# EAGLE design Adafruit Pro Trinket 3v3 (EAGLE 6.3)
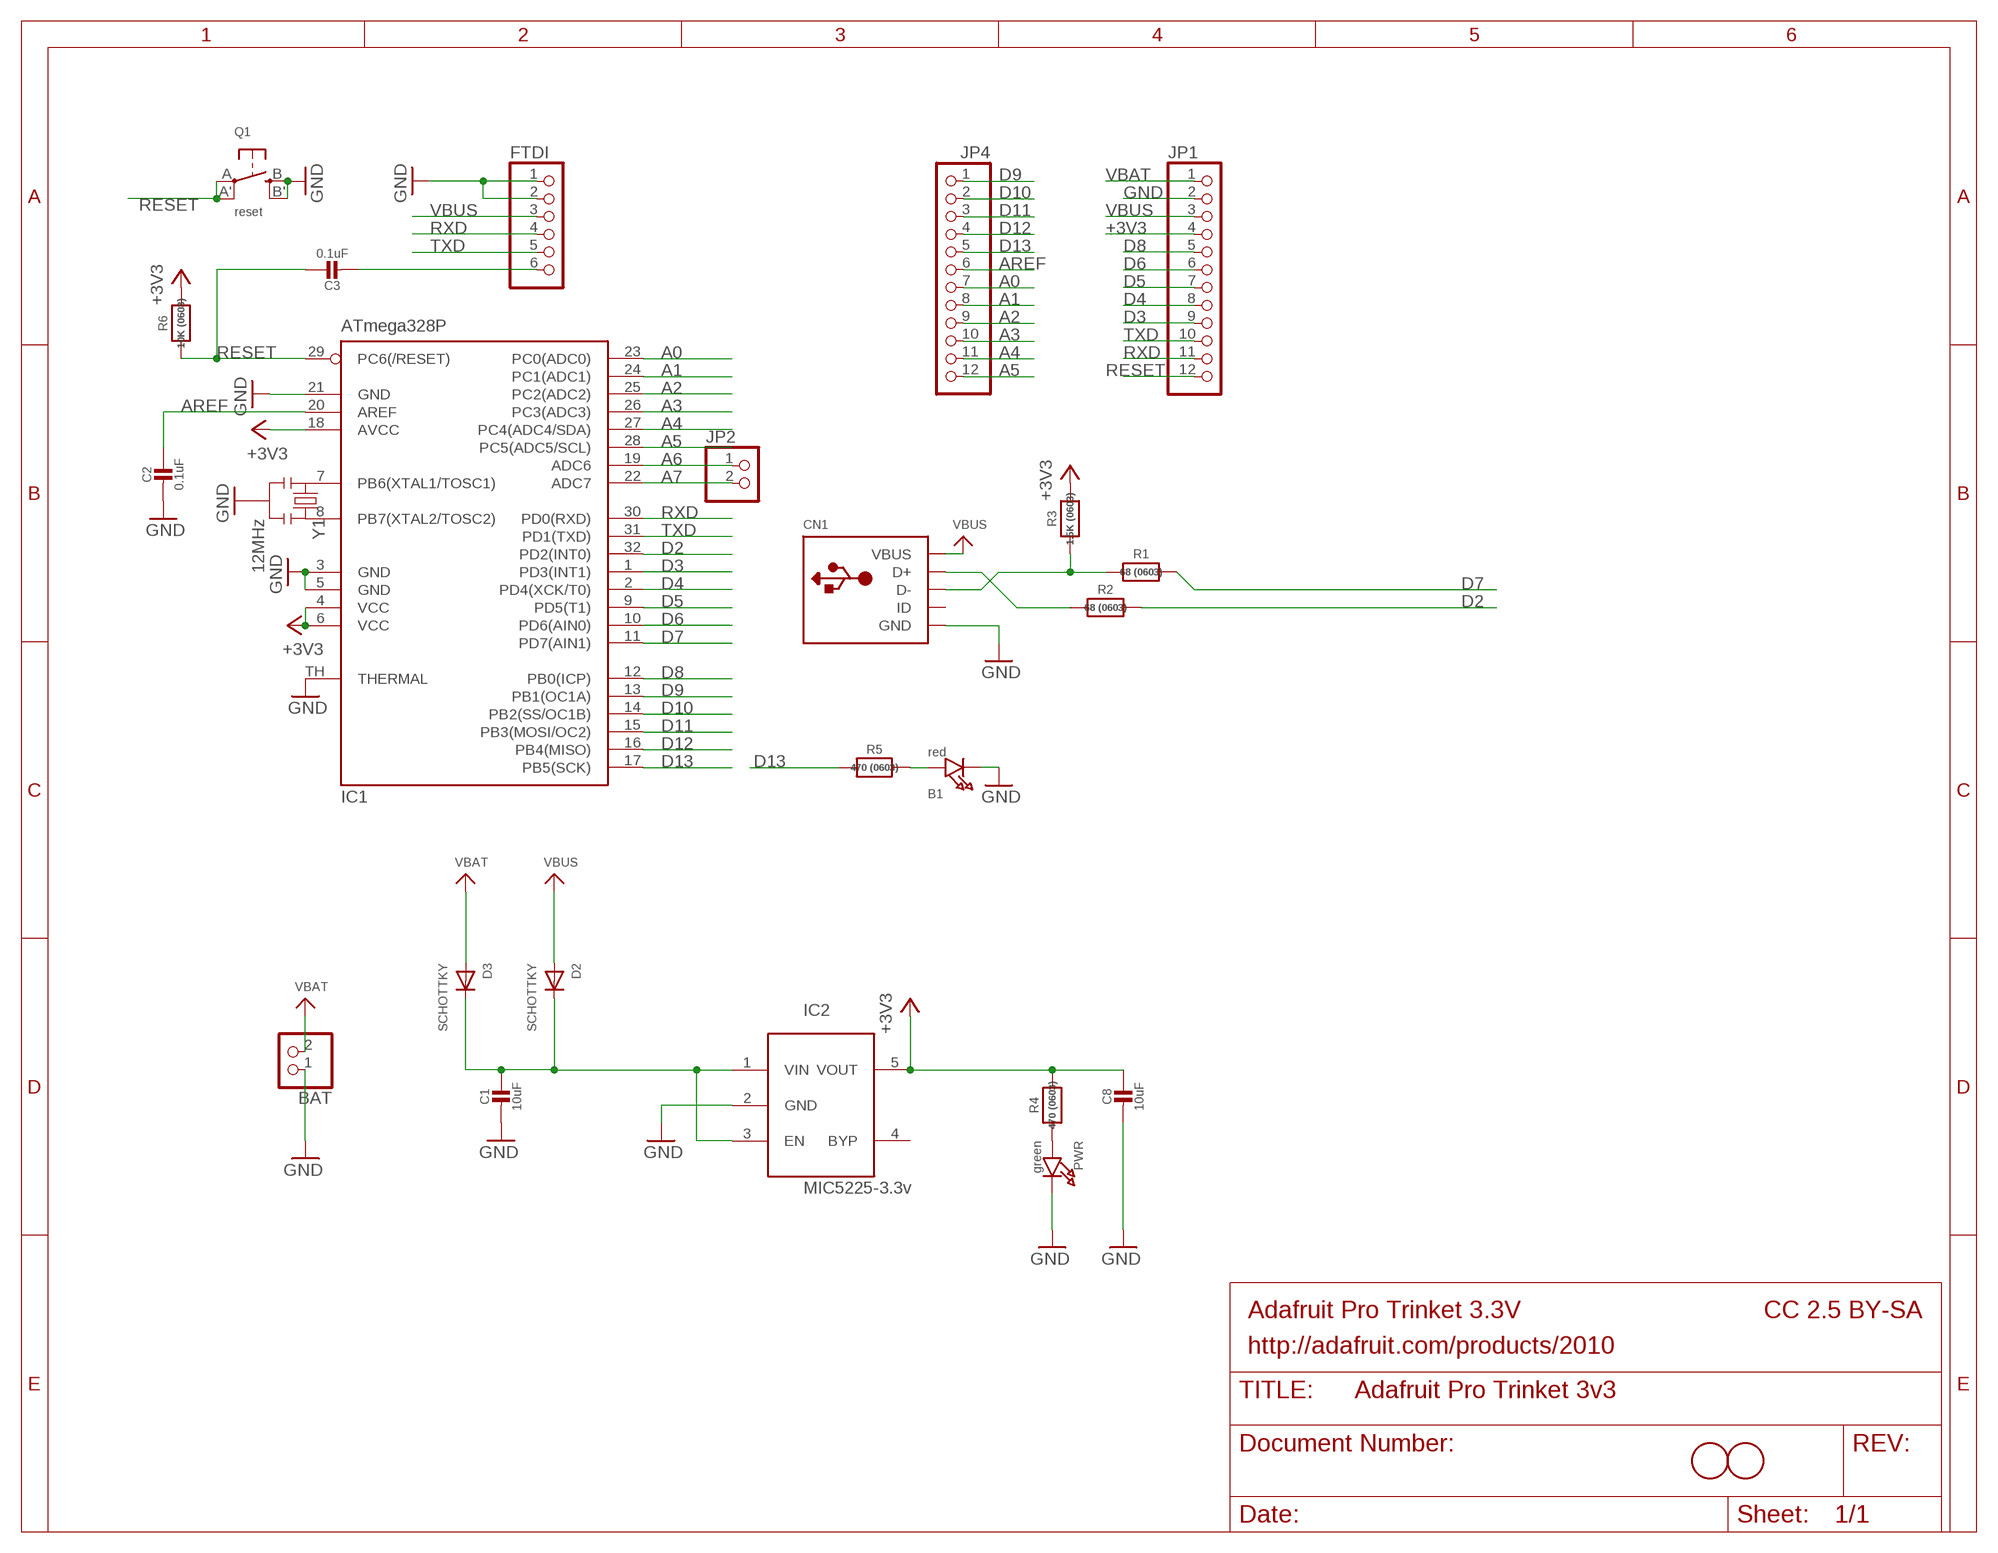
[diagram p0: schematic, sheet 1]

## Parts
B1  red  LED0805_NOOUTLINE  [CHIPLED_0805_NOOUTLINE]
BAT  CON_JST_PH_2PIN  [JSTPH2]
C1  10uF  CAP_CERAMIC0805-NOOUTLINE  [0805-NO]
C2  0.1uF  CAP_CERAMIC_0805MP  [_0805MP]
C3  0.1uF  CAP_CERAMIC0805-NOOUTLINE  [0805-NO]
C8  10uF  CAP_CERAMIC0805-NOOUTLINE  [0805-NO]
CN1  USBMICRO_20329  [4UCONN_20329]
D2  SCHOTTKY  DIODE_SOD-123FL  [SOD-123FL]
D3  SCHOTTKY  DIODE_SOD-123FL  [SOD-123FL]
FTDI  PINHD-1X6CB  [1X06-CLEANBIG]
IC1  ATmega328P  MEGA8-MI  [MLF32-TH]
IC2  MIC5225-3.3v  LP298XS  [SOT23-5L]
JP1  PINHD-1X12-CB  [1X12-CB]
JP2  HEADER-1X2ROUND  [1X02_ROUND]
JP4  PINHD-1X12-CB  [1X12-CB]
PWR  green  LED0805_NOOUTLINE  [CHIPLED_0805_NOOUTLINE]
Q1  reset  SWITCH_TACT_SMT4.6X2.8  [BTN_KMR2_4.6X2.8]
R1  68 (0603)  RESISTOR_0603_NOOUT  [0603-NO]
R2  68 (0603)  RESISTOR_0603_NOOUT  [0603-NO]
R3  1.5K (0603)  RESISTOR_0603_NOOUT  [0603-NO]
R4  470 (0603)  RESISTOR_0603_NOOUT  [0603-NO]
R5  470 (0603)  RESISTOR_0603_NOOUT  [0603-NO]
R6  10K (0603)  RESISTOR0805_NOOUTLINE  [0805-NO]
U$1  FIDUCIAL  [FIDUCIAL_1MM]
U$6  FIDUCIAL  [FIDUCIAL_1MM]
Y1  12MHz  RESONATORSMD  [RESONATOR-SMD]

## Nets
+3V3 [power]: C8.1 IC1.4(VCC) IC1.6(VCC) IC1.18(AVCC) IC2.5(VOUT) JP1.4 R3.2 R4.2 R6.2
A0: IC1.23(PC0(ADC0)) JP4.7
A1: IC1.24(PC1(ADC1)) JP4.8
A2: IC1.25(PC2(ADC2)) JP4.9
A3: IC1.26(PC3(ADC3)) JP4.10
A4: IC1.27(PC4(ADC4/SDA)) JP4.11
A5: IC1.28(PC5(ADC5/SCL)) JP4.12
A6: IC1.19(ADC6) JP2.1
A7: IC1.22(ADC7) JP2.2
AREF: C2.1 IC1.20(AREF) JP4.6
D2: IC1.32(PD2(INT0)) R2.2
D3: IC1.1(PD3(INT1)) JP1.9
D4: IC1.2(PD4(XCK/T0)) JP1.8
D5: IC1.9(PD5(T1)) JP1.7
D6: IC1.10(PD6(AIN0)) JP1.6
D7: IC1.11(PD7(AIN1)) R1.2
D8: IC1.12(PB0(ICP)) JP1.5
D9: IC1.13(PB1(OC1A)) JP4.1
D10: IC1.14(PB2(SS/OC1B)) JP4.2
D11: IC1.15(PB3(MOSI/OC2)) JP4.3
D12: IC1.16(PB4(MISO)) JP4.4
D13: IC1.17(PB5(SCK)) JP4.5 R5.2
D+: CN1.D+ R2.1
D-: CN1.D- R1.1 R3.1
DTR/RTS: C3.2 FTDI.6
GND [power]: B1.C BAT.1 C1.2 C2.2 C8.2 CN1.BASE@1(GND) CN1.BASE@2(GND) CN1.GND CN1.SPRT@1(GND) CN1.SPRT@2(GND) CN1.SPRT@3(GND) CN1.SPRT@4(GND) FTDI.1 FTDI.2 IC1.3(GND) IC1.5(GND) IC1.21(GND) IC1.TH(THERMAL) IC2.2(GND) JP1.2 PWR.C Q1.B'(S1) Q1.B(S) Y1.2
N$1: B1.A R5.1
N$2: IC1.8(PB7(XTAL2/TOSC2)) Y1.3
N$3: IC1.7(PB6(XTAL1/TOSC1)) Y1.1
N$6: PWR.A R4.1
N$7: C1.1 D2.C D3.C IC2.1(VIN) IC2.3(EN)
RESET: C3.1 IC1.29(PC6(/RESET)) JP1.12 Q1.A'(P1) Q1.A(P) R6.1
RXD: FTDI.4 IC1.30(PD0(RXD)) JP1.11
TXD: FTDI.5 IC1.31(PD1(TXD)) JP1.10
VBAT [power]: BAT.2 D3.A JP1.1
VBUS [power]: CN1.VBUS D2.A FTDI.3 JP1.3
Unconnected: CN1.ID IC2.4(BYP)

## Notes on the sheet
- Adafruit Pro Trinket 3.3V | CC 2.5 BY-SA
- http://adafruit.com/products/2010

## Library data of the parts
B1 PWR = microbuilder:LED: LED 0603 - 0603 Surface Mount Package 2mA: Green LED - Low Power (3.9mcd, 2ma, 1.7Vf) - Digikey: 475-2709-2-ND Orange LED - Low Power (9.8mcd, 2ma, 1.8Vf) - Digikey: 475-1194-2-ND Red LED - Low Power (5mcd, 2ma, 1.8Vf) - Digikey: 475-1195-2-ND Yellow LED - Low Power (7mcd, 2ma, 1.8Vf) - Digikey: 475-1196-2-ND 5mA: Blue LED - Low Power (17mcd, 5ma, 2.9Vf) - Digikey: LNJ937W8CRACT-ND 0805 - 0805 Surface Mount Package 2mA: Red LED (8.8mcd, 2mA, 1.8Vf, Clear) - Low Power [Digikey: 475-2510-1-ND] Green LED (5mcd, 2mA, 1.8Vf, Clear) - Low Power [Digikey: 475-2730-1-ND] Yellow LED (11.3mcd, 2mA, 1.8Vf, Clear) - Low Power [Digikey: 475-2555-1-ND] 20mA: Red LED (104mcd, 20mA, Diffused) - LS R976 [Digikey: 475-1278-6-ND] Red LED (12mcd, 20mA, 2.0Vf, Clear) - APT2012EC [Digikey: 754-1128-1-ND] Green LED (15mcd, 20mA, 2.2Vf, Clear) - APT2012GC [Digikey: 754-1131-1-ND] Orange LED (160mcd, 20mA, 2.1Vf, Clear) - APT2012SECK [Digikey: 754-1130-1-ND] 1206 - 1206 Surface Mount Package Green LED (26mcd, 20mA, Diffused) - LG N971 [Digikey: 475-1407-6-ND] Red LED (15mcd, 20mA, Diffused) - LH N974 [Digikey: 475-1416-6-ND] Cree - Cree High-Power Surface Mount LEDs XPEBWT-L1-0000-00D50 - White 111lm 350mA 2.9Vf 6200K 110° XTEAWT-00-0000-00000LEE3 - White 114lm 350mA 2.85Vf 5000K 115° Everlight - Everlight 45-21 Series Surface Mount LEDs 45-21/QK2C-B2832AC2CB2/2T - Warm White 2000mcd 20mA 3.25Vf 3050K 120° 45-21/LK2C-B38452C4CB2/2T - Nuetral White 2000mcd 20mA 3.25Vf 4150K 120° 45-21/LK2C-B50634C6CB2/2T - Cold White 2200mcd 20mA 3.25Vf 5650K 120° PLCC2 Reverse Mount LS T77K-J1L2-1-0-2-R18-Z - Red 11.25mcd 2mA 1.8Vf 630nm 120° LO T77K-L1M2-24-Z - Orange 19.6mcd 2mA 1.8Vf 606nm 120° LY T77K-K2M1-26-Z - Yellow 15.7mcd 2mA 1.8Vf 587nm 120°
BAT = microbuilder:CON_JST_PH_2PIN: JST 2-Pin Right-Angle Connector PH-Series - 4UConnector: 17311 SH-Series - 4UConnector: 07278
C1-C3 C8 = microbuilder:CAP_CERAMIC: Ceramic Capacitors For new designs, use the packages preceded by an '_' character since they are more reliable: The following footprints should be used on most boards: _0402 - Standard footprint for regular board layouts _0603 - Standard footprint for regular board layouts _0805 - Standard footprint for regular board layouts _1206 - Standard footprint for regular board layouts For extremely tight-pitch boards where space is at a premium, the following 'micro-pitch' footprints can be used (smaller pads, no silkscreen outline, etc.): _0402MP - Micro-pitch footprint for very dense/compact boards _0603MP - Micro-pitch footprint for very dense/compact boards _0805MP - Micro-pitch footprint for very dense/compact boards _1206MP - Micro-pitch footprint for very dense/compact boards
CN1 = microbuilder:USB: USB Connectors USBMINIB - Surface Mount Female Mini-B USB Connector 4UConnector: 06564
D2 D3 = adafruit:DIODE: Diode SMADIODE - SMA Surface Mount Package 20V 1A Schottky Diode Digikey: 641-1014-6-ND DO-1N4148 - Through Hole Small Current Diode SOD-123 20V 1 A (.5mV Vf) Schottky Diode - Digikey: MBRX120TPMSCT-ND SOD-323 10V 570mA (.38mV Vf, 3ns) Schottky Diode - Digikey: ZLLS410CT-ND SOD-523 30V 30mA Schottky Diode (RB751S-40TE61) - Digikey: RB751S-40TE61CT-ND SOT23-R/W - SOT23 Package (R = Solder Paste/Reflow Ovens, W = Hand-Soldering) BAT54Film 40V 300mA - Digikey: 497-7162-1-ND
FTDI = adafruit:PINHD-1X6: PIN HEADER
IC1 = microbuilder:MEGA8-MI: MICROCONTROLLER 8 Kbytes FLASH, 1 kbytes SRAM, 512 bytes EEPROM, USART, 6-channel 10 bit ADC, 2-channel 8 bit ADC Pin compatible with Atmega48, ATMega88, ATMega168 Source: avr.lbr; MPN: ATMEGA88PA-MU; OC_FARNELL: 1715491; OC_NEWARK: 15R0272
IC2 = adafruit:LP298X
JP1 JP4 = adafruit:PINHD-1X12: PIN HEADER
JP2 = microbuilder:HEADER-1X2: PIN HEADER
Q1 = microbuilder:SWITCH_TACT_SMT: SMT Tact Switches 6x6mm - Digikey: P12940SCT-ND KMR2 (4.6x2.8mm) - Digikey: 401-1426-1-ND EVQ-PQHB55 - Light Touch, 160GF (4.5x4.5mm) - Digikey: P8090SCT-ND KMT0 - KMT021 NGJ LHS (etc.) IP68/Waterproof - Digikey: CKN10289CT-ND
R1-R6 = microbuilder:RESISTOR: Resistors For new designs, use the packages preceded by an '_' character since they are more reliable: The following footprints should be used on most boards: _0402 - Standard footprint for regular board layouts _0603 - Standard footprint for regular board layouts _0805 - Standard footprint for regular board layouts _1206 - Standard footprint for regular board layouts For extremely tight-pitch boards where space is at a premium, the following 'micro-pitch' footprints can be used (smaller pads, no silkscreen outline, etc.): _0402MP - Micro-pitch footprint for very dense/compact boards _0603MP - Micro-pitch footprint for very dense/compact boards _0805MP - Micro-pitch footprint for very dense/compact boards _1206MP - Micro-pitch footprint for very dense/compact boards
U$1 U$6 = adafruit:FIDUCIAL: For use by pick and place machines to calibrate the vision/machine, 1mm By microbuilder.eu
Y1 = SparkFun:RESONATOR: Resonator Small SMD resonator. This is the itty bitty 10/20MHz resonators with built in caps. CSTCE10M0G55 and CSTCE20M0V53. Footprint has been reviewed closely but hasn't been tested yet.

## Net classes
1 power: width 0.305 mm

## Board
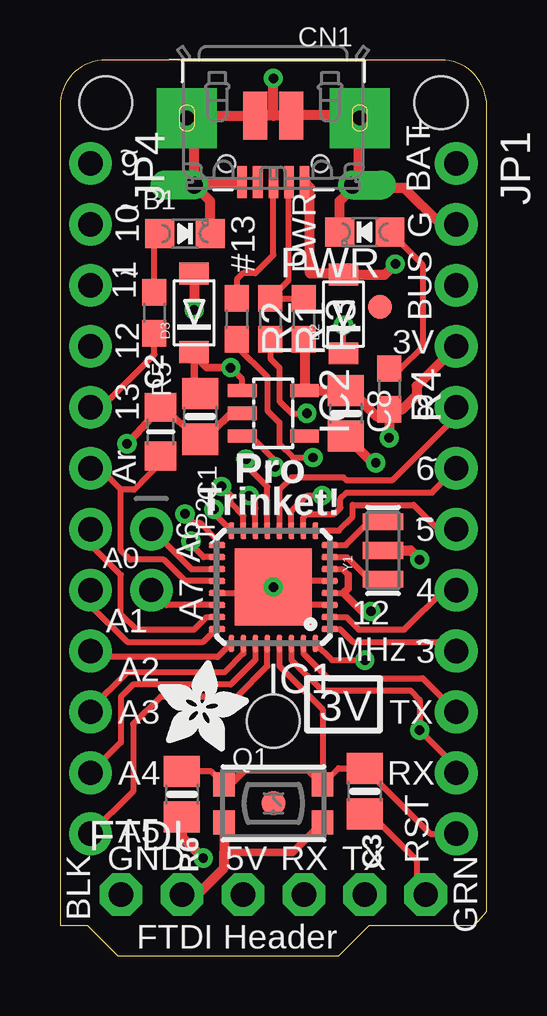
[diagram p1: board, top side]
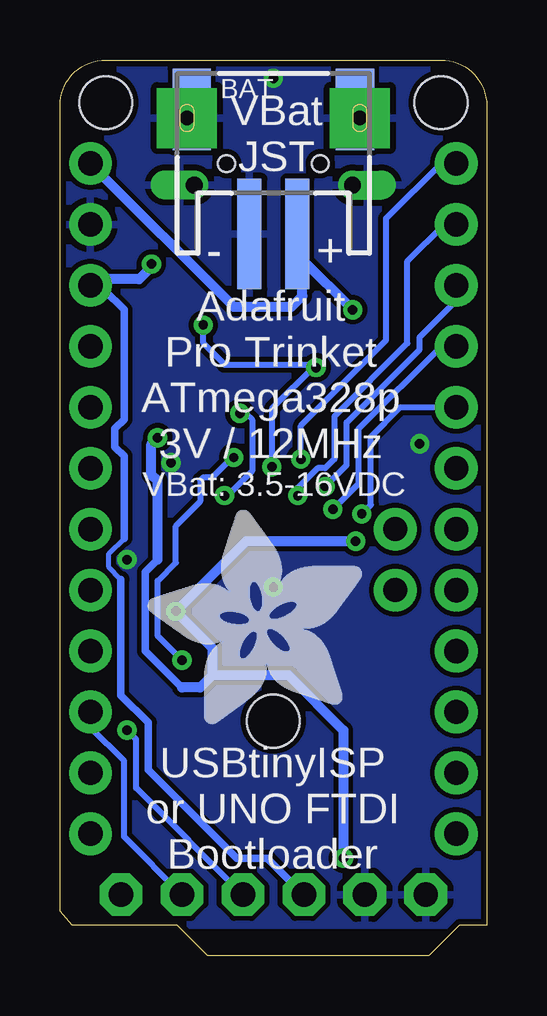
[diagram p2: board, bottom side, seen from below]

Size 17.78 x 37.34 mm. Coordinates in mm from the lower left corner, seen from the top.
Outline: 17.78,1.84 17.78,35.43 arc90 15.88,37.34 1.91,37.34 arc90 0,35.43 0,1.27 1.14,1.27 2.41,0 11.62,0 12.89,1.27 17.27,1.27 17.78,1.84
Copper layers (1*16): Top 0.035mm / dielectric 1.5mm / Bottom 0.035mm
Design rules "adafruit *": minimum track width 8mil, minimum drill 15.5mil, track to track 8mil, track to pad 8mil, pad to pad 8mil, via to via 8mil, smd to smd 8mil, copper to edge 10mil, drill to drill 8mil, minimum pad ring 10mil, minimum via ring 8mil, stop-mask expansion 2mil, vias tented up to drill 20mil, thermal gap 10mil
Holes 2.2 mm at 1.91,35.56 15.88,35.56 8.89,9.78

### Footprints (pad centres in the part's own frame; a part is rotated, then mirrored left to right if it is on the bottom)
CHIPLED_0805_NOOUTLINE = smd 1.2 x 1.2: A 0,-1.05; C 0,1.05
JSTPH2 = smd 1 x 4.6: 1 -1,-3.7; 2 1,-3.7 | smd 1.6 x 3.4: NC1 -3.4,1.5; NC2 3.4,1.5
0805-NO = smd 1.3 x 1.5: 1 -0.95,0; 2 0.95,0
_0805MP = smd 1.2 x 1.3: 1 -1.016,0; 2 1.016,0
4UCONN_20329 = smd 1 x 2: BASE@1 -0.75,-2; BASE@2 0.75,-2 | smd 0.4 x 1.35: D+ 0,0.775; D- -0.65,0.775; GND 1.3,0.775; ID 0.65,0.775; VBUS -1.3,0.775 | drill 0.7 offset: SPRT@1 -3.3,0.9; SPRT@2 3.3,0.9 | drill 0.6 pad 2.5 square: SPRT@3 -3.6,-1.9; SPRT@4 3.6,-1.9 | hole 0.7: -1.95,0; 1.95,0
SOD-123FL = smd 0.91 x 1.22: A 1.637,0; C -1.637,0
1X06-CLEANBIG = drill 1.016 pad 1.778 octagon: 1 -6.35,0; 2 -3.81,0; 3 -1.27,0; 4 1.27,0; 5 3.81,0; 6 6.35,0
MLF32-TH = smd 0.7 x 0.25: 1 -2.35,1.75; 2 -2.35,1.25; 3 -2.35,0.75; 4 -2.35,0.25; 5 -2.35,-0.25; 6 -2.35,-0.75; 7 -2.35,-1.25; 8 -2.35,-1.75; 17 2.35,-1.75; 18 2.35,-1.25; 19 2.35,-0.75; 20 2.35,-0.25; 21 2.35,0.25; 22 2.35,0.75; 23 2.35,1.25; 24 2.35,1.75 | smd 0.25 x 0.7: 9 -1.75,-2.35; 10 -1.25,-2.35; 11 -0.75,-2.35; 12 -0.25,-2.35; 13 0.25,-2.35; 14 0.75,-2.35; 15 1.25,-2.35; 16 1.75,-2.35; 25 1.75,2.35; 26 1.25,2.35; 27 0.75,2.35; 28 0.25,2.35; 29 -0.25,2.35; 30 -0.75,2.35; 31 -1.25,2.35; 32 -1.75,2.35 | smd 3.2 x 3.2: TH 0,0
SOT23-5L = smd 0.55 x 1.2: 1 -0.95,-1.3; 2 0,-1.3; 3 0.95,-1.3; 4 0.95,1.3; 5 -0.95,1.3
1X12-CB = drill 1.016 pad 1.778: 1 -13.97,0; 2 -11.43,0; 3 -8.89,0; 4 -6.35,0; 5 -3.81,0; 6 -1.27,0; 7 1.27,0; 8 3.81,0; 9 6.35,0; 10 8.89,0; 11 11.43,0; 12 13.97,0
1X02_ROUND = drill 1 pad 1.778: 1 -1.27,0; 2 1.27,0
BTN_KMR2_4.6X2.8 = smd 0.9 x 1: A 2.05,0.8; A' -2.05,0.8; B 2.05,-0.8; B' -2.05,-0.8
0603-NO = smd 1.1 x 1: 1 -0.85,0; 2 0.85,0
FIDUCIAL_1MM = smd 1 x 1: 1 0,0
RESONATOR-SMD = smd 0.7 x 1.7: 1 -1.2,0; 2 0,0; 3 1.2,0

### Placement (x,y rotation side)
B1  5.21,30.1 270 top
BAT  8.89,33.78 0 bottom
C1  5.84,22.48 270 top
C2  4.19,21.84 90 top
C3  12.7,6.86 270 top
C8  11.91,22.61 270 top
CN1  8.89,33.02 180 top
D2  11.81,26.75 90 top
D3  5.59,26.8 90 top
FTDI  8.89,2.54 0 top
IC1  8.89,15.37 180 top
IC2  8.89,22.61 270 top
JP1  16.51,19.05 270 top
JP2  3.81,16.51 270 top
JP4  1.27,19.05 270 top
PWR  12.7,30.16 90 top
Q1  8.89,6.35 0 top
R1  8.76,26.54 270 top
R2  7.37,26.54 270 top
R3  10.16,26.54 270 top
R4  13.72,23.62 270 top
R5  3.94,26.8 270 top
R6  5.08,6.73 270 top
U$1  13.34,27.05 0 top
U$6  8.89,6.35 0 top
U$7  [ADAFRUIT_3.5MM]  4.06,8.51 0 top
U$9  [ADAFRUIT_9MM]  5.21,9.65 90 bottom
Y1  13.46,16.89 90 top

### Tracks (layer width: path | path; a pad name or v marks a point on that pad's centre or on a via)
+3V3  (via drill 0.39)
  Top 0.254: IC1.18 5.99,16.62 5.46,17.14 | IC1.6 11.76,16.12 12,15.88 | IC1.4 11.81,15.12 11.81,15.11
  Top 0.305: 12,15.88 12,15.3 11.81,15.11 12.57,14.35 v12.95,14.35 | 5.46,17.14 v5.46,17.27
  Top 0.406: 10.29,23.65 IC2.5 | IC2.5 C8.1 12.13,23.56 13.21,22.48 13.63,22.48 13.63,22.68 R4.2 | JP1.4 14.86,23.75 14.86,23.37 14.26,22.77 R4.2 | R4.2 v13.72,21.59 | R3.2 10.19,25.66 IC2.5 | R6.2 5.08,4.95 v5.97,4.06
  Bottom 0.305: 12.7,11.18 14.22,12.7 14.22,16 13.72,16.51
  Bottom 0.406: 13.72,16.51 13.72,19.81 13.97,20.07 13.97,21.34 v13.72,21.59 | 11.43,11.68 8.26,11.68 5.97,9.4 v5.97,4.06 | 11.43,11.68 11.94,11.18 12.7,11.18 | v5.46,17.27 10.03,17.27 v12.95,14.35 11.43,12.83 11.43,11.68
A0
  Top 0.254: IC1.23 6.12,14.12 5.59,13.59 3.18,13.59 2.54,14.22 2.54,15.88 1.27,17.14 JP4.7
A1
  Top 0.254: JP4.8 1.27,14.61 2.79,13.08 5.97,13.08 6.51,13.62 IC1.24
A2
  Top 0.254: 7.14,12.86 IC1.25 6.57,12.45 1.52,12.45 JP4.9
A3
  Top 0.254: JP4.10 1.27,10.29 2.79,11.81 6.86,11.81 7.64,12.59 IC1.26
A4
  Top 0.254: JP4.11 2.54,8.89 2.54,10.79 3.05,11.3 7.11,11.3 8.14,12.33 IC1.27
A5
  Top 0.254: IC1.28 8.64,12.07 7.37,10.79 4.19,10.79 3.05,9.65 3.05,6.86 JP4.12
A6
  Top 0.254: JP2.1 5.47,16.12 IC1.19
A7
  Top 0.254: IC1.22 4.43,14.62 JP2.2
AREF
  Top 0.254: IC1.20 5.21,15.62 4.32,16.51 2.92,16.51 2.54,16.89 2.54,19.43 | 2.54,19.43 1.65,20.32 JP4.6 | 2.54,19.43 3.09,19.43 4.23,20.61 C2.1
D2  (via drill 0.39)
  Top 0.254: v12.7,12.32 11.34,12.32 IC1.32 | 10.03,20.76 v10.54,20.76 9.72,20.76 9.14,21.34 9.14,22.22 8.64,22.73 8.64,24.13 7.37,25.4 R2.2
  Bottom 0.254: v12.7,12.32 13.72,13.33 13.72,15.62 12.95,16.38 12.95,17.91 11.94,18.92 11.94,19.81 11.81,19.94 11.43,19.94 10.6,20.76 v10.54,20.76
D3
  Top 0.254: IC1.1 11.66,13.62 12.19,13.08 16.13,13.08 JP1.9
D4
  Top 0.254: IC1.2 11.92,14.12 12.45,13.59 14.35,13.59 16,15.24 JP1.8
D5
  Top 0.254: IC1.9 11.62,17.72 12.19,18.29 12.19,18.8 14.73,18.8 15.75,17.78 JP1.7
D6
  Top 0.254: IC1.10 10.14,18.27 10.29,18.41 11.43,18.41 11.68,18.67 11.68,19.05 11.94,19.3 15.49,19.3 JP1.6
D7  (via drill 0.39)
  Top 0.254: R1.2 8.76,24.89 9.14,24.51 9.14,23.11 9.65,22.61 v10.29,22.61 | IC1.11 9.64,18.53 10.29,19.18 v10.92,19.18
  Bottom 0.254: v10.29,22.61 10.03,22.61 9.78,22.35 9.78,20.19 10.79,19.18 v10.92,19.18
D8
  Top 0.254: JP1.5 16.51,22.48 13.84,19.81 11.94,19.81 11.81,19.94 9.65,19.94 9.14,19.43 IC1.12
D9  (via drill 0.39)
  Top 0.254: IC1.13 8.64,19.55 7.75,20.45 v7.75,20.7
  Bottom 0.254: v7.75,20.7 7.75,22.1 4.19,25.65 4.19,30.73 1.91,33.02 JP4.1
D10  (via drill 0.39)
  Top 0.254: IC1.14 8.14,18.66 8.13,18.67 8.13,18.92 v7.87,19.18
  Bottom 0.254: JP4.2 1.78,30.48 3.3,28.96 3.3,25.53 6.35,22.48 6.35,20.7 6.73,20.32 7.05,20.32 7.87,19.49 v7.87,19.18
D11  (via drill 0.39)
  Top 0.254: IC1.15 7.64,18.33 7.11,18.86 7.11,19.18 v6.73,19.56 6.99,19.3
  Bottom 0.254: v6.73,19.56 5.84,20.45 5.84,22.22 2.79,25.27 2.79,25.78 1.27,27.3 JP4.3
D12  (via drill 0.39)
  Top 0.254: IC1.16 6.41,18.44 v6.41,18.61
  Bottom 0.254: v6.41,18.61 5.33,19.68 5.33,21.97 1.91,25.4 JP4.4
D13  (via drill 0.39)
  Top 0.254: IC1.17 6.54,17.34 5.84,18.03 5.59,18.03 v5.21,18.41 | R5.2 3.94,25.06 1.74,22.86 JP4.5
  Bottom 0.254: v5.21,18.41 4.83,18.8 4.83,21.63 3.6,22.86 JP4.5
D+
  Top 0.254: R2.1 7.37,28.19 7.62,28.45 8.13,28.45 8.89,29.21 CN1.D+
D-
  Top 0.254: CN1.D- 9.54,30.85 9.53,30.48 9.53,28.16 R1.1 R3.1
DTR/RTS
  Top 0.254: FTDI.6 14.86,2.92 14.86,3.98 12.93,5.91 C3.2
GND  (via drill 0.39)
  Top 0.254: IC1.5 9.14,15.62 | IC1.3 9.64,14.62 | IC1.21 8.64,15.12
  Top 0.305: 8.64,15.12 IC1.TH | 9.14,15.62 IC1.TH | 9.64,14.62 IC1.TH | Q1.B 9.69,4.3 6.84,4.3 | v2.79,21.34 C2.2 5.78,21.59 C1.2 6.16,21.84 6.35,21.84 7.11,22.61 IC2.2
  Top 0.406: Y1.2 14.61,16.89 v14.99,16.51 | Q1.B' 6.84,4.3 6.84,3.67 5.72,2.54 FTDI.2 | PWR.C 11.65,31.45 12.19,31.99 CN1.SPRT@1 | CN1.BASE@1 9.33,35.02 | 9.33,35.02 8.87,35.02 | 8.87,35.02 CN1.BASE@2 5.68,35.02 5.46,34.8 | 8.87,35.02 8.89,35 v8.89,36.58 | CN1.GND 5.72,32.25 CN1.SPRT@2 | CN1.SPRT@2 5.59,34.67 5.46,34.8 | 5.46,34.8 5.33,34.93 | 9.33,35.02 9.36,35.05 12.45,35.05 12.45,32.38 CN1.SPRT@1 | JP1.2 15.88,30.48 14.35,32 12.31,32 CN1.SPRT@1 | B1.C 6.26,31.45 CN1.SPRT@2 | C8.2 13.02,20.55 v13.16,20.55
  other vias: 8.89,15.37
  pour Bottom: 0,38.1 0,1.27 17.78,1.27 17.78,38.1
N$1
  Top 0.254: R5.1 3.94,29.88 B1.A
N$2
  Top 0.254: IC1.8 11.91,17.12 12.83,18.03 13.41,18.03 Y1.3
N$3
  Top 0.254: IC1.7 11.96,16.62 12.88,15.69 Y1.1
N$6
  Top 0.254: PWR.A 15.11,28.8 15.11,25.4 14.19,24.47 R4.1
N$7  (via drill 0.39)
  Top 0.254: IC2.1 7.59,24.03 v7.11,24.51 | D2.C 11.94,24.98 11.81,24.89 v11.81,26.29 | v8.95,20.38 8.95,20.64 8,21.59 7.66,21.59 IC2.3 | 5.72,24.91 5.59,25.03 D3.C
  Top 0.305: C1.1 5.59,23.68 D3.C | 5.72,24.91 6.11,24.51 v7.11,24.51
  Bottom 0.254: 7.11,24.64 10.92,24.64 11.81,25.53 v11.81,26.29 | 7.11,24.64 v7.11,24.51 | 7.11,24.64 8.95,22.8 v8.95,20.38
RESET
  Top 0.254: IC1.29 9.14,12.07 10.94,10.27 Q1.A 11.6,7.81 C3.1 15.43,5.08 JP1.12 | Q1.A' 6.31,7.68 R6.1
  Top 0.305: Q1.A 10.34,7.75 7.69,7.75 7.09,7.15 Q1.A'
RXD  (via drill 0.39)
  Top 0.254: IC1.30 9.64,12.33 10.92,11.05 14.61,11.05 14.99,10.67 v14.99,9.4 16.51,7.87 JP1.11
  Bottom 0.254: FTDI.4 14.61,6.98 14.61,9.02 v14.99,9.4
TXD
  Top 0.254: IC1.31 10.14,12.59 11.18,11.56 15.11,11.56 JP1.10
  Bottom 0.254: FTDI.5 15.11,4.95 15.11,8.13 16.51,9.53 JP1.10
VBAT  (via drill 0.39)
  Top 0.406: D3.A v5.59,26.92
  Bottom 0.406: v5.59,26.92 7.68,29.02 | 7.68,29.02 7.89,29.23 BAT.2 | JP1.1 10.54,27.05 8.13,27.05 7.68,27.5 7.68,29.02
VBUS  (via drill 0.39)
  Top 0.406: v13.97,28.83 13.53,28.38 D2.A 11.75,28.45 10.41,28.45 10.41,32.02 CN1.VBUS
  Bottom 0.203: 15.24,15.68 15.75,16.19 15.75,16.76 15.11,17.4
  Bottom 0.305: FTDI.3 9.14,4.06 10.41,4.06 14.1,7.75 14.1,9.71 15.24,10.86 15.24,15.68 | 15.11,17.4 15.11,20.83 15.49,21.21 15.49,21.97 15.11,22.35 15.11,26.92 15.94,27.75 16.32,27.75 JP1.3
  Bottom 0.406: v13.97,28.83 13.97,28.7 14.48,28.19 16.26,28.19 JP1.3

### Text on the board
tPlace: + | 9 | ~ | BAT | ~ | G | 11 | 10 | BUS | ~ | #13 | PWR | 12 | 3V | 13 | 8 | Ar | Pro | 6 | ~ | Trinket! | 5 | ~ | A0 | A6 | 4 | A1 | A7 | 12 / MHz | ~ | A2 | 3 | A3 | 3V | TX | A4 | RX | RST | A5 | BLK | GND | 5V | RX | TX | GRN | FTDI Header
bPlace: VBat / JST | + | - | Adafruit / Pro Trinket / ATmega328p / 3V / 12MHz | VBat: 3.5-16VDC | USBtinyISP / or UNO FTDI / Bootloader